# Altium schematic sheet controleSTM.SchDoc
size A2; SheetNumber: 1; SheetTotal: 2
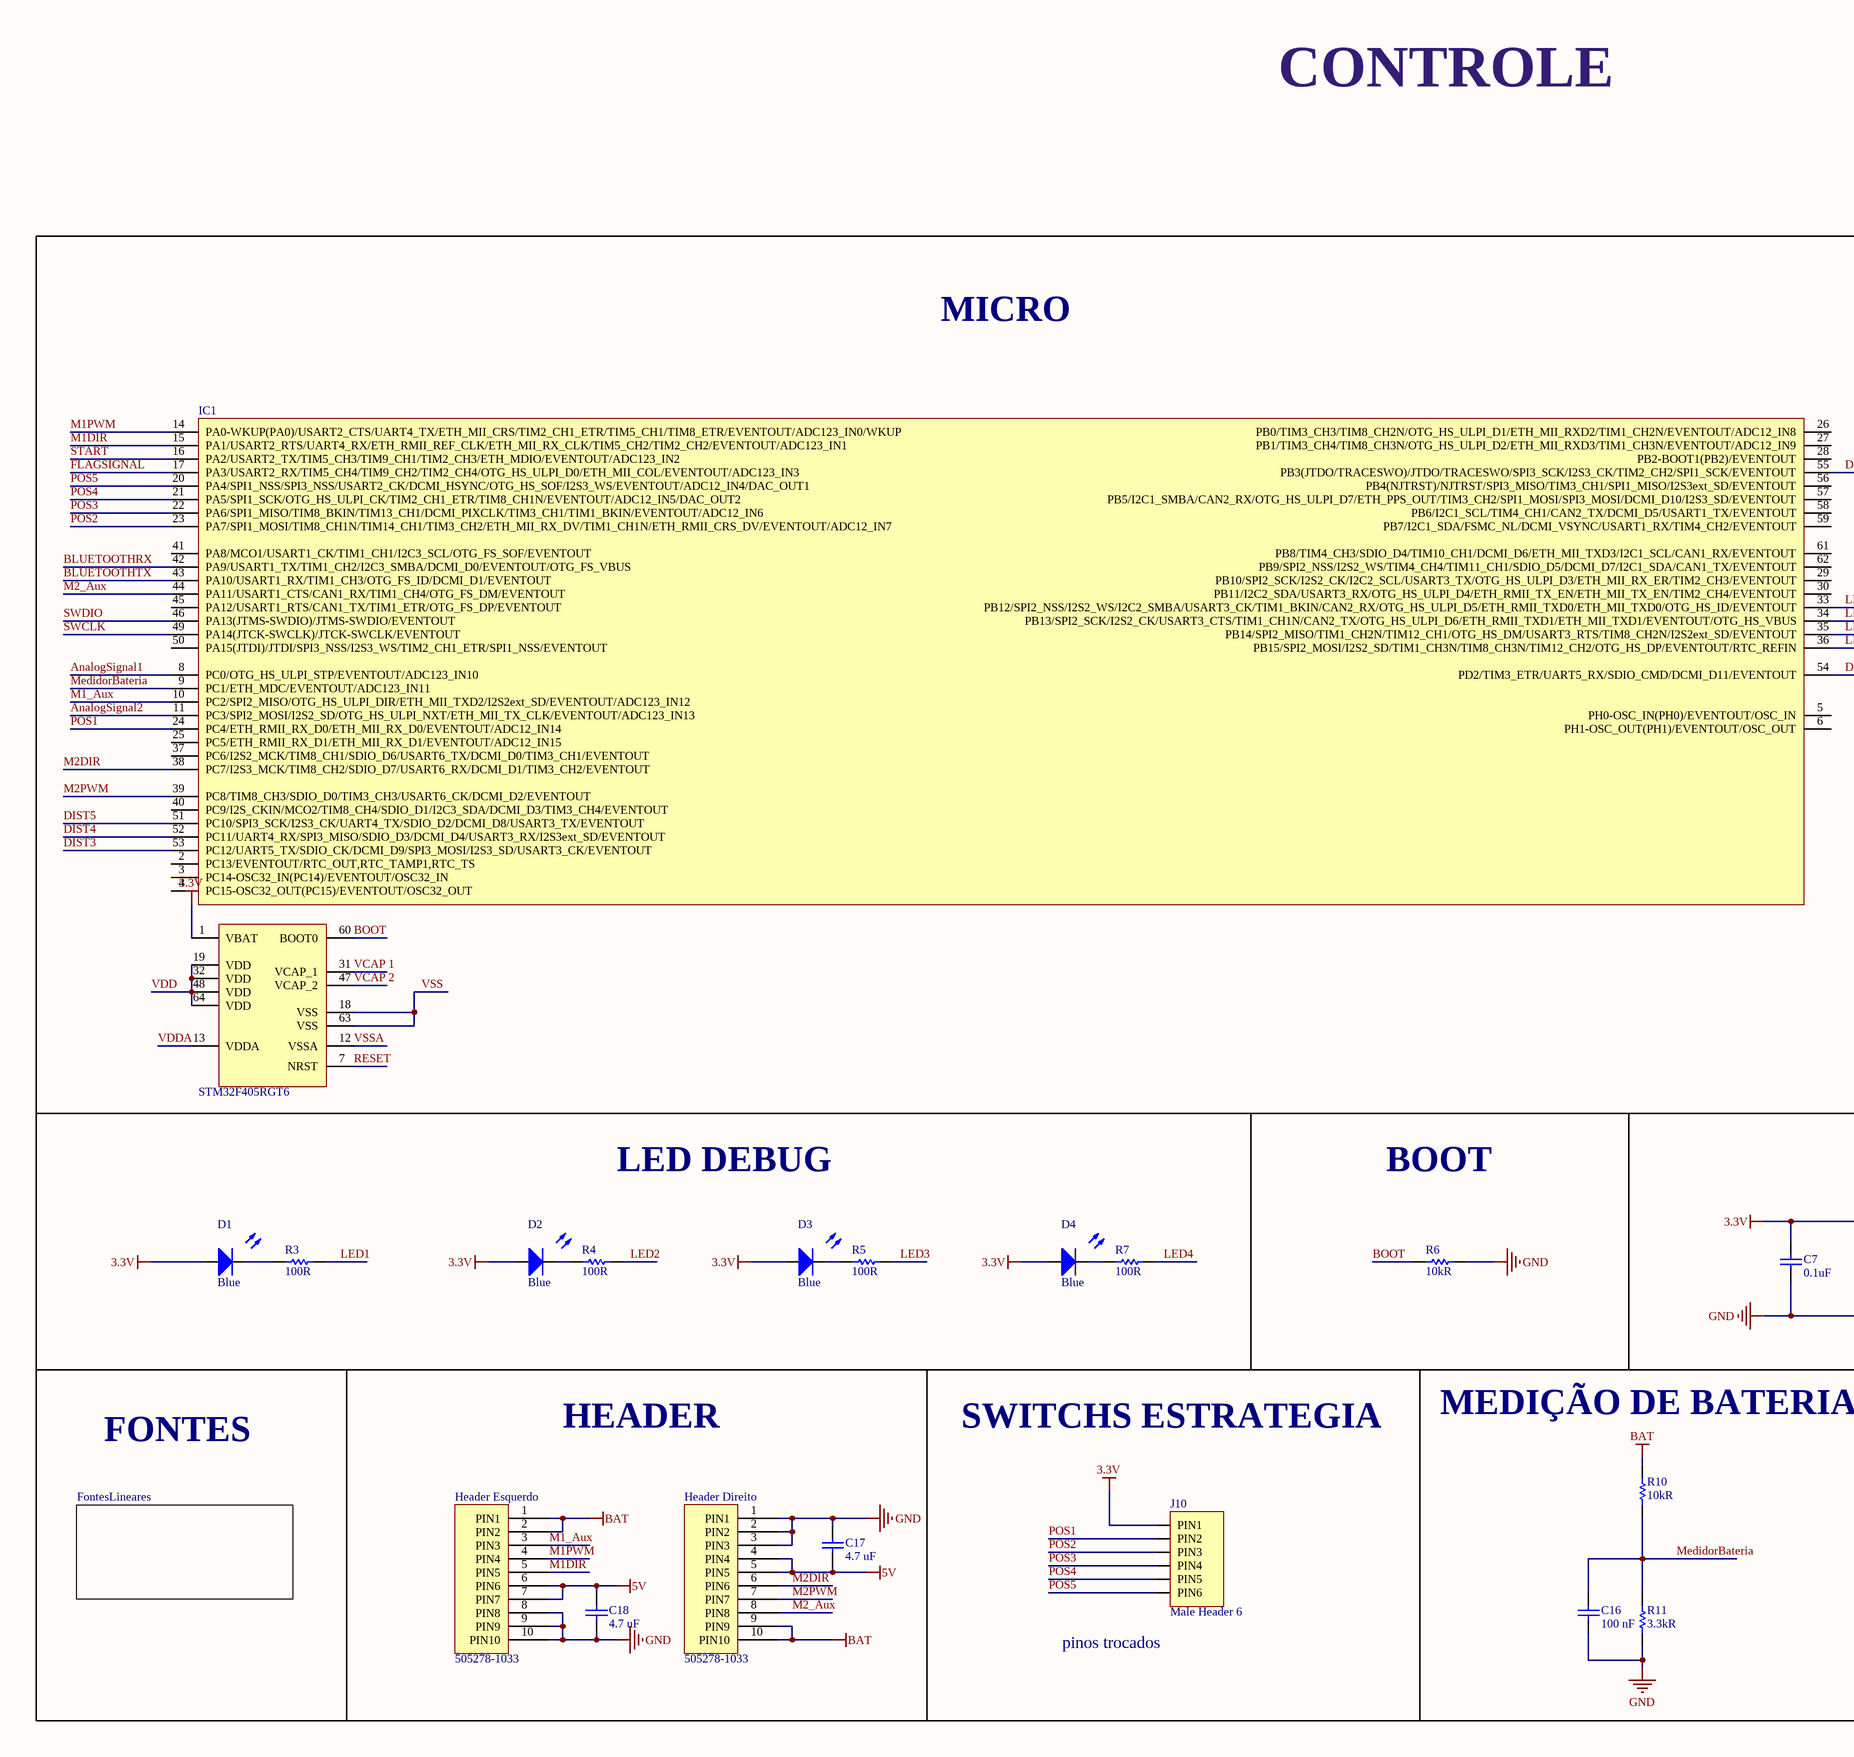
[diagram p0: controleSTM.SchDoc, left]
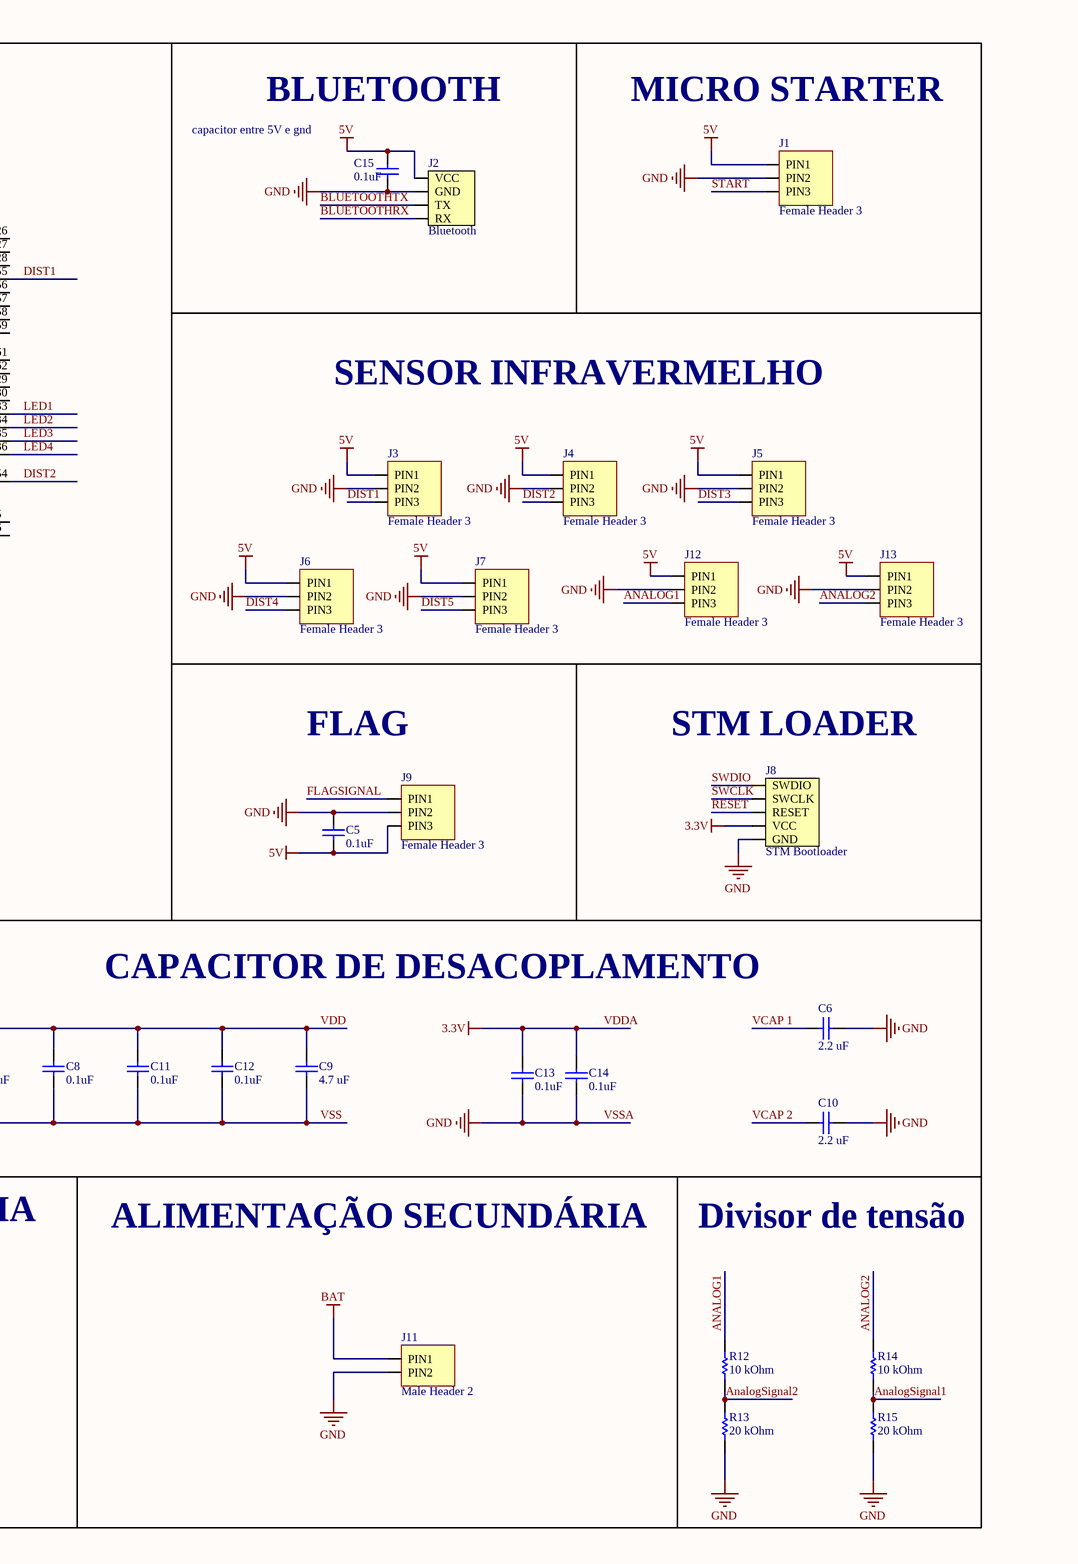
[diagram p1: controleSTM.SchDoc, right]

## Parts
C5  0.1uF  [C0805]
C6  2.2 uF  [C0805]
C7  0.1uF  [C0805]
C8  0.1uF  [C0805]
C9  4.7 uF  [C0805]
C10  2.2 uF  [C0805]
C11  0.1uF  [C0805]
C12  0.1uF  [C0805]
C13  0.1uF  [C0805]
C14  0.1uF  [C0805]
C15  0.1uF  [C0805]
C16  100 nF  [C0805]
C17  4.7 uF  [C0805]
C18  4.7 uF  [C0805]
D1  Blue  [DIODO_2-SMD-3215]
D2  Blue  [DIODO_2-SMD-3215]
D3  Blue  [DIODO_2-SMD-3215]
D4  Blue  [DIODO_2-SMD-3215]
Header_Direito  505278-1033  [FPC_CON]
Header_Esquerdo  505278-1033  [FPC_CON]
IC1  STM32F405RGT6  [LQFP-64]
J1  Female Header 3  [FEMALE HEADER 3]
J2  Bluetooth  [BLUETOOTH]
J3  Female Header 3  [FEMALE HEADER 3]
J4  Female Header 3  [FEMALE HEADER 3]
J5  Female Header 3  [FEMALE HEADER 3]
J6  Female Header 3  [FEMALE HEADER 3]
J7  Female Header 3  [FEMALE HEADER 3]
J8  STM Bootloader  [STM BOOTLOADER]
J9  Female Header 3  [FEMALE HEADER 3]
J10  Male Header 6  [MALE HEADER 6]
J11  Male Header 2  [MALE HEADER 2]
J12  Female Header 3  [FEMALE HEADER 3]
J13  Female Header 3  [FEMALE HEADER 3]
R3  100R  [RESISTOR_0805]
R4  100R  [RESISTOR_0805]
R5  100R  [RESISTOR_0805]
R6  10kR  [RESISTOR_0603]
R7  100R  [RESISTOR_0805]
R10  10kR  [RESISTOR_0603]
R11  3.3kR  [RESISTOR_0603]
R12  10 kOhm  [RESISTOR_0603]
R13  20 kOhm  [RESISTOR_0603]
R14  10 kOhm  [RESISTOR_0603]
R15  20 kOhm  [RESISTOR_0603]

## Sub-sheets
FontesLineares = FontesLineares: no entries

## Nets
5V: C5.1 C15.2 C17.1 C18.2 Header_Direito.4(PIN4) Header_Direito.5(PIN5) Header_Esquerdo.6(PIN6) Header_Esquerdo.7(PIN7) J1.PIN1 J2.VCC J3.PIN1 J4.PIN1 J5.PIN1 J6.PIN1 J7.PIN1 J9.PIN3 J12.PIN1 J13.PIN1
BAT: Header_Direito.9(PIN9) Header_Direito.10(PIN10) Header_Esquerdo.1(PIN1) Header_Esquerdo.2(PIN2) J11.PIN1 R10.2
VDD: C7.2 C8.2 C9.2 C11.2 C12.2 C13.2 C14.2 D1.A D2.A D3.A D4.A IC1.1(VBAT) IC1.13(VDDA) IC1.19(VDD) IC1.32(VDD) IC1.48(VDD) IC1.64(VDD) J8.VCC J10.PIN1  [also labelled 3.3V, VDDA]
VSS: C5.2 C6.2 C7.1 C8.1 C9.1 C10.2 C11.1 C12.1 C13.1 C14.1 C15.1 C16.1 C17.2 C18.1 Header_Direito.1(PIN1) Header_Direito.2(PIN2) Header_Direito.3(PIN3) Header_Esquerdo.8(PIN8) Header_Esquerdo.9(PIN9) Header_Esquerdo.10(PIN10) IC1.12(VSSA) IC1.18(VSS) IC1.63(VSS) J1.PIN2 J2.GND J3.PIN2 J4.PIN2 J5.PIN2 J6.PIN2 J7.PIN2 J8.GND J9.PIN2 J11.PIN2 J12.PIN2 J13.PIN2 R6.2 R11.1 R13.1 R15.1  [also labelled GND, VSSA]
ANALOG1: J12.PIN3 R12.2
ANALOG2: J13.PIN3 R14.2
AnalogSignal1: IC1.8(PC0/OTG_HS_ULPI_STP/EVENTOUT/ADC123_IN10) R14.1 R15.2
AnalogSignal2: IC1.11(PC3/SPI2_MOSI/I2S2_SD/OTG_HS_ULPI_NXT/ETH_MII_TX_CLK/EVENTOUT/ADC123_IN13) R12.1 R13.2
BLUETOOTHRX: IC1.42(PA9/USART1_TX/TIM1_CH2/I2C3_SMBA/DCMI_D0/EVENTOUT/OTG_FS_VBUS) J2.RX
BLUETOOTHTX: IC1.43(PA10/USART1_RX/TIM1_CH3/OTG_FS_ID/DCMI_D1/EVENTOUT) J2.TX
BOOT: IC1.60(BOOT0) R6.1
DIST1: IC1.55(PB3(JTDO/TRACESWO)/JTDO/TRACESWO/SPI3_SCK/I2S3_CK/TIM2_CH2/SPI1_SCK/EVENTOUT) J3.PIN3
DIST2: IC1.54(PD2/TIM3_ETR/UART5_RX/SDIO_CMD/DCMI_D11/EVENTOUT) J4.PIN3
DIST3: IC1.53(PC12/UART5_TX/SDIO_CK/DCMI_D9/SPI3_MOSI/I2S3_SD/USART3_CK/EVENTOUT) J5.PIN3
DIST4: IC1.52(PC11/UART4_RX/SPI3_MISO/SDIO_D3/DCMI_D4/USART3_RX/I2S3ext_SD/EVENTOUT) J6.PIN3
DIST5: IC1.51(PC10/SPI3_SCK/I2S3_CK/UART4_TX/SDIO_D2/DCMI_D8/USART3_TX/EVENTOUT) J7.PIN3
FLAGSIGNAL: IC1.17(PA3/USART2_RX/TIM5_CH4/TIM9_CH2/TIM2_CH4/OTG_HS_ULPI_D0/ETH_MII_COL/EVENTOUT/ADC123_IN3) J9.PIN1
LED1: IC1.33(PB12/SPI2_NSS/I2S2_WS/I2C2_SMBA/USART3_CK/TIM1_BKIN/CAN2_RX/OTG_HS_ULPI_D5/ETH_RMII_TXD0/ETH_MII_TXD0/OTG_HS_ID/EVENTOUT) R3.2
LED2: IC1.34(PB13/SPI2_SCK/I2S2_CK/USART3_CTS/TIM1_CH1N/CAN2_TX/OTG_HS_ULPI_D6/ETH_RMII_TXD1/ETH_MII_TXD1/EVENTOUT/OTG_HS_VBUS) R4.2
LED3: IC1.35(PB14/SPI2_MISO/TIM1_CH2N/TIM12_CH1/OTG_HS_DM/USART3_RTS/TIM8_CH2N/I2S2ext_SD/EVENTOUT) R5.2
LED4: IC1.36(PB15/SPI2_MOSI/I2S2_SD/TIM1_CH3N/TIM8_CH3N/TIM12_CH2/OTG_HS_DP/EVENTOUT/RTC_REFIN) R7.2
M1_Aux: Header_Esquerdo.3(PIN3) IC1.10(PC2/SPI2_MISO/OTG_HS_ULPI_DIR/ETH_MII_TXD2/I2S2ext_SD/EVENTOUT/ADC123_IN12)
M1DIR: Header_Esquerdo.5(PIN5) IC1.15(PA1/USART2_RTS/UART4_RX/ETH_RMII_REF_CLK/ETH_MII_RX_CLK/TIM5_CH2/TIM2_CH2/EVENTOUT/ADC123_IN1)
M1PWM: Header_Esquerdo.4(PIN4) IC1.14(PA0-WKUP(PA0)/USART2_CTS/UART4_TX/ETH_MII_CRS/TIM2_CH1_ETR/TIM5_CH1/TIM8_ETR/EVENTOUT/ADC123_IN0/WKUP)
M2_Aux: Header_Direito.8(PIN8) IC1.44(PA11/USART1_CTS/CAN1_RX/TIM1_CH4/OTG_FS_DM/EVENTOUT)
M2DIR: Header_Direito.6(PIN6) IC1.38(PC7/I2S3_MCK/TIM8_CH2/SDIO_D7/USART6_RX/DCMI_D1/TIM3_CH2/EVENTOUT)
M2PWM: Header_Direito.7(PIN7) IC1.39(PC8/TIM8_CH3/SDIO_D0/TIM3_CH3/USART6_CK/DCMI_D2/EVENTOUT)
MedidorBateria: C16.2 IC1.9(PC1/ETH_MDC/EVENTOUT/ADC123_IN11) R10.1 R11.2
POS1: IC1.24(PC4/ETH_RMII_RX_D0/ETH_MII_RX_D0/EVENTOUT/ADC12_IN14) J10.PIN2
POS2: IC1.23(PA7/SPI1_MOSI/TIM8_CH1N/TIM14_CH1/TIM3_CH2/ETH_MII_RX_DV/TIM1_CH1N/ETH_RMII_CRS_DV/EVENTOUT/ADC12_IN7) J10.PIN3
POS3: IC1.22(PA6/SPI1_MISO/TIM8_BKIN/TIM13_CH1/DCMI_PIXCLK/TIM3_CH1/TIM1_BKIN/EVENTOUT/ADC12_IN6) J10.PIN4
POS4: IC1.21(PA5/SPI1_SCK/OTG_HS_ULPI_CK/TIM2_CH1_ETR/TIM8_CH1N/EVENTOUT/ADC12_IN5/DAC_OUT2) J10.PIN5
POS5: IC1.20(PA4/SPI1_NSS/SPI3_NSS/USART2_CK/DCMI_HSYNC/OTG_HS_SOF/I2S3_WS/EVENTOUT/ADC12_IN4/DAC_OUT1) J10.PIN6
RESET: IC1.7(NRST) J8.RESET
START: IC1.16(PA2/USART2_TX/TIM5_CH3/TIM9_CH1/TIM2_CH3/ETH_MDIO/EVENTOUT/ADC123_IN2) J1.PIN3
SWCLK: IC1.49(PA14(JTCK-SWCLK)/JTCK-SWCLK/EVENTOUT) J8.CLK(SWCLK)
SWDIO: IC1.46(PA13(JTMS-SWDIO)/JTMS-SWDIO/EVENTOUT) J8.DIO(SWDIO)
VCAP 1: C6.1 IC1.31(VCAP_1)
VCAP 2: C10.1 IC1.47(VCAP_2)
NetD1_C: D1.C R3.1
NetD2_C: D2.C R4.1
NetD3_C: D3.C R5.1
NetD4_C: D4.C R7.1

Not connected (* = marked no-connect by the designer): IC1 2(PC13/EVENTOUT/RTC_OUT,RTC_TAMP1,RTC_TS) 3(PC14-OSC32_IN(PC14)/EVENTOUT/OSC32_IN) 4(PC15-OSC32_OUT(PC15)/EVENTOUT/OSC32_OUT) 5(PH0-OSC_IN(PH0)/EVENTOUT/OSC_IN) 6(PH1-OSC_OUT(PH1)/EVENTOUT/OSC_OUT) 25(PC5/ETH_RMII_RX_D1/ETH_MII_RX_D1/EVENTOUT/ADC12_IN15) 26(PB0/TIM3_CH3/TIM8_CH2N/OTG_HS_ULPI_D1/ETH_MII_RXD2/TIM1_CH2N/EVENTOUT/ADC12_IN8) 27(PB1/TIM3_CH4/TIM8_CH3N/OTG_HS_ULPI_D2/ETH_MII_RXD3/TIM1_CH3N/EVENTOUT/ADC12_IN9) 28(PB2-BOOT1(PB2)/EVENTOUT) 29(PB10/SPI2_SCK/I2S2_CK/I2C2_SCL/USART3_TX/OTG_HS_ULPI_D3/ETH_MII_RX_ER/TIM2_CH3/EVENTOUT) 30(PB11/I2C2_SDA/USART3_RX/OTG_HS_ULPI_D4/ETH_RMII_TX_EN/ETH_MII_TX_EN/TIM2_CH4/EVENTOUT) 37(PC6/I2S2_MCK/TIM8_CH1/SDIO_D6/USART6_TX/DCMI_D0/TIM3_CH1/EVENTOUT) 40(PC9/I2S_CKIN/MCO2/TIM8_CH4/SDIO_D1/I2C3_SDA/DCMI_D3/TIM3_CH4/EVENTOUT) 41(PA8/MCO1/USART1_CK/TIM1_CH1/I2C3_SCL/OTG_FS_SOF/EVENTOUT) 45(PA12/USART1_RTS/CAN1_TX/TIM1_ETR/OTG_FS_DP/EVENTOUT) 50(PA15(JTDI)/JTDI/SPI3_NSS/I2S3_WS/TIM2_CH1_ETR/SPI1_NSS/EVENTOUT) 56(PB4(NJTRST)/NJTRST/SPI3_MISO/TIM3_CH1/SPI1_MISO/I2S3ext_SD/EVENTOUT) 57(PB5/I2C1_SMBA/CAN2_RX/OTG_HS_ULPI_D7/ETH_PPS_OUT/TIM3_CH2/SPI1_MOSI/SPI3_MOSI/DCMI_D10/I2S3_SD/EVENTOUT) 58(PB6/I2C1_SCL/TIM4_CH1/CAN2_TX/DCMI_D5/USART1_TX/EVENTOUT) 59(PB7/I2C1_SDA/FSMC_NL/DCMI_VSYNC/USART1_RX/TIM4_CH2/EVENTOUT) 61(PB8/TIM4_CH3/SDIO_D4/TIM10_CH1/DCMI_D6/ETH_MII_TXD3/I2C1_SCL/CAN1_RX/EVENTOUT) 62(PB9/SPI2_NSS/I2S2_WS/TIM4_CH4/TIM11_CH1/SDIO_D5/DCMI_D7/I2C1_SDA/CAN1_TX/EVENTOUT)

## Notes on the sheet
- CONTROLE
- MICRO
- capacitor entre 5V e gnd
- BLUETOOTH
- MICRO STARTER
- SENSOR INFRAVERMELHO
- FLAG
- (near J8) STM LOADER
- LED DEBUG
- BOOT
- CAPACITOR DE DESACOPLAMENTO
- FONTES
- HEADER
- SWITCHS ESTRATEGIA
- MEDIÇÃO DE BATERIA
- ALIMENTAÇÃO SECUNDÁRIA
- Divisor de tensão
- (near J10) pinos trocados

## Library data of the parts
C5 C7 C8 C11-C15 = C0805C104M3RACTU: CAP CER 0.1uF 25V X7R 0805; Manufacturer: Kemet; Tolerance: 20%; Voltage - Rated: 25 VDC; Library Control - Checked Footprint: No; Library Control - Checked Schematic: Yes; Library Control - Person that Checked Schematic: Guilherme; Library Control - Person that did the Last Update Schematic: Marcos; Supplier 1: Mouser; Part Number: C0805C104M3RACTU; Category: Ceramic Capacitor; Price: 1=0,13 10=0,064 100=0,037 1000=0,025 (USD); Supplier Part Number 1: 80-C0805C104M3R; Library Ref: Capacitor; Operating Temperature: -55 C ~ 125 C; Package / Case: 0805(2012 mestric); Size / Dimension: 1.25 mm W x 2 mm L x 0.78 mm H; Value: 0.1uF; ESR: -; Dieletric: X7R; Library Control - Last Update: 26/06/2021 20:52; ComponentLink1Description: Datasheet; ComponentLink1URL: https://br.mouser.com/datasheet/2/212/KEM_C1002_X7R_SMD-1102033.pdf; ComponentLink2Description: Mouser Link; ComponentLink2URL: https://br.mouser.com/ProductDetail/KEMET/C0805C104M3RACTU?qs=jbCUrP3sAgSIdMuvv9W4Pg%3D%3D
C6 C10 = GCM21BR71C225KA64L: CAP CER 2.2uF 16V X7R 0805; Manufacturer: MURATA ELECTRONICS; Tolerance: 10%; Voltage - Rated: 16 VDC; Library Control - Checked Footprint: Yes; Library Control - Person that Checked Footprint: Cage; Supplier 1: Mouser; Part Number: GCM21BR71C225KA64L; Category: Ceramic capacitor; Price: 1=0,41 10=0,283 100=0,169 1000=0,107 (USD); Supplier Part Number 1: 81-GCM21BR71C225KA4L; Library Ref: Capacitor; Operating Temperature: -55°C ~125ºC; Package / Case: 0805(2012 Metric); Size / Dimension: 2 mm L  x 1.25 mm W x 1.25 mm H; Value: 2.2 uF; ESR: -; Dieletric: X7R; Library Control - Checked Schematic: Yes; Library Control - Last Update: 25/08/22; Library Control - Person that Checked Schematic: Cage; Library Control - Person that did the Last Update Footprint: Cage; Library Control - Person that did the Last Update Schematic: Cage; ComponentLink1Description: Datasheet; ComponentLink1URL: https://br.mouser.com/ProductDetail/Murata-Electronics/GCM21BR71C225KA64L?qs=aEuGZpxfbxV0E5XH%252BwYupA%3D%3D; ComponentLink2Description: Mouser Link; ComponentLink2URL: https://br.mouser.com/ProductDetail/Murata-Electronics/GCM21BR71C225KA64L?qs=aEuGZpxfbxV0E5XH%252BwYupA%3D%3D
C9 C17 C18 = GRM219R61E475KA73D: CAP CER 4.7uF 25V X5R 0805; Manufacturer: MURATA ELECTRONICS; Tolerance: 10%; Voltage - Rated: 25 VDC; Library Control - Checked Footprint: Yes; Library Control - Person that Checked Footprint: Cage; Supplier 1: Mouser; Part Number: GRM219R61E475KA73D; Category: Ceramic Capacitors; Price: 1=0,28 10=0,193 100=0,098 1000=0,059 (USD); Supplier Part Number 1: 81-GRM219R61E475KA73D; Library Ref: Capacitor; Operating Temperature: -55°C ~ 85°C; Package / Case: 0805(2012 metric); Size / Dimension: 2 mm L x 1.25 mm W x 0.85 mm H; ESR: -; Dieletric: X5R; Library Control - Checked Schematic: Yes; Library Control - Last Update: 25/08/22; Library Control - Person that Checked Schematic: Cage; Library Control - Person that did the Last Update Footprint: Cage; Library Control - Person that did the Last Update Schematic: Cage; ComponentLink1Description: Datasheet; ComponentLink1URL: https://br.mouser.com/datasheet/2/281/1/GRM219R61E475KA73_01A-1986363.pdf; ComponentLink2Description: Mouser Link; ComponentLink2URL: https://br.mouser.com/ProductDetail/Murata-Electronics/GRM219R61E475KA73D?qs=%2Fha2pyFadui1540apPxqrcvNL2Od6%2FE9q78FE8iyERiL9ZO4NhnlONCgyc%2FC2rEQ; Value: 4.7 uF
C16 = 885012207128: CAP CER 100 nF 100V X7R 0805; Manufacturer: Wurth Elektronik; Tolerance: 10%; Voltage - Rated: 100 VDC; Library Control - Checked Footprint: Yes; Supplier 1: Mouser; Part Number: 885012207128; Category: Ceramic capacitor; Price: 1=0,41 10=0,283 100=0,169 1000=0,107 (USD); Supplier Part Number 1: 710-885012207128; Library Ref: Capacitor; Operating Temperature: -55°C ~125ºC; Package / Case: 0805(2012 Metric); Size / Dimension: 2 mm L  x 1.25 mm W x 1.25 mm H; Value: 100 nF; ESR: -; Dieletric: X7R; Library Control - Checked Schematic: Yes; ComponentLink1Description: Datasheet; ComponentLink1URL: https://br.mouser.com/datasheet/2/445/885012207128-1727772.pdf; ComponentLink2Description: Mouser Link; ComponentLink2URL: https://br.mouser.com/ProductDetail/Wurth-Elektronik/885012207128?qs=MLItCLRbWsys1TnbPEYt%252BQ%3D%3D
D1-D4 = EAST3215BA5: LED 75mW BLUE 45MCD 3215; Manufacturer: Everlight Electronics; Current - Forward (If): 20 mA; Voltage - Forward (Vf): 3,30 V; Viewing Angle: 130°; Wavelength: 468 nm; Reverse Voltage: 5 V; Library Control - Checked Footprint: yes; Library Control - Person that Checked Footprint: Lucas; Library Control - Person that did the Last Update Footprint: Stéfany (Ster); Supplier 1: Mouser; Part Number: EAST3215BA5; Category: Standard LEDs - SMD; Price: 1 = 0,3800, 10 = 0,2050, 100 = 0.1080 (USD); Package / Case: 3215; Color: Blue; Operating Temperature: - 40 °C ~ 85 °C; Luminous Intensity: 45 mcd; Library Ref: Diodo/Led; Supplier Part Number 1: 638-EAST3215BA5; Max Power Dissipation: 75 mW; Max Current Rating: 20 mA; Library Control - Checked Schematic: yes; Library Control - Last Update: 13/06/2021 12:45; Library Control - Person that Checked Schematic: Lucas; Library Control - Person that did the Last Update Schematic: Stéfany (Ster); ComponentLink1Description: Mouser Link; ComponentLink1URL: https://www.mouser.com/ProductDetail/Everlight/EAST3215BA5?qs=Cqqh%252BS766wnzp9nQVj5A4g==; ComponentLink2Description: Datasheet; ComponentLink2URL: https://www.mouser.com/datasheet/2/143/EAST3215BA5-1154292.pdf
Header_Direito Header_Esquerdo = 505278-1033_BODY: CONN FFC/FPC HORZ 10POS 0.50MM; Manufacturer: Molex; Current Rating (Amps): 500mA; Number of Positions: 10; Library Control - Checked Footprint: Yes; Library Control - Last Project that Used: Follow-Final; Library Control - Person that Checked Footprint: Lucas; Library Control - Person that did the Last Update Footprint: Mateus(Dimas); Supplier 1: Mouser; Part Number: 505278-1033; Category: Connectors; Price: 1=0,51000, 10=0,42900, 100=0,33400 (USD); Mounting Type: Right Angle; Contact Material: Tin; Operating Temperature: -40°C ~ 85°C; Library Ref: Connectors; Number of Rows: 1; Termination: SMD; Insulation Material: Liquid Crystal Polymer; Contact Type: FFC/FPC; Pitch: 0.50mm; Contact Length - Mating: 0.50mm; Supplier Part Number 1: 538-505278-1033; Library Control - Checked Schematic: Yes; Library Control - Last Update: 24/04/2021 00:25; Library Control - Person that Checked Schematic: Lucas; Library Control - Person that did the Last Update Schematic: Mateus(Dimas); ComponentLink1Description: Datasheet; ComponentLink1URL: https://br.mouser.com/datasheet/2/276/2/5052781033_FFC_FPC_CONNECTORS-772019.pdf; ComponentLink2Description: Mouser Link; ComponentLink2URL: https://br.mouser.com/ProductDetail/Molex/505278-1033?qs=c8NFF48pVsDStgrQCBOSTg%3D%3D
IC1 = STM32F405RGT6: IC MCU 32-BIT 192kB FLASH ARM Cortex-M4 168MHz  LQFP-64; Manufacturer: STM; Number of I/Os: 51; Oscillator Type: Internal; Program Memory Size: 1024kB; Peripherals: CAN, I2C, SDIO, I2S / SPI, UART / USART, USB; Core Processor: ARM Cortex M0+; Voltage - Supply (Vcc/Vdd): 1.8 V to 3.6 V; Number of Timers/Counters: 17; Number of ADC Channels: 16; Number of SPI Channels: 3; Number of UART/USART Channels: 4; Library Control - Person that did the Last Update Footprint: Marcos; Supplier 1: Mouser; Part Number: STM32F405RGT6; Category: ARM Microcontrollers - MCU; Price: 1 = 12,95, 10 = 11,91,  100 = 11,42, 500 = 8,95 (USD); Package/Case: LQFP-64; Operating Temperature: -40°C to 85°C; Connectivity: -; Speed: 168MHz; Program Memory Type: Flash; RAM Size: 192k B; Core Size: *; Number of I2C Channels: 3; Number of Ethernet Channels: -; Series: STM32F405RG; Library Ref: Microcrontrollers; Supplier Part Number 1: 511-STM32F405RGT6; Library Control - Checked Footprint: *; Library Control - Checked Schematic: *; Library Control - Last Project that Used: *; Library Control - Last Update: 22/08/21 15:09; Library Control - Person that Checked Footprint: *; Library Control - Person that Checked Schematic: *; Library Control - Person that did the Last Update Schematic: Marcos; ComponentLink1Description: Mouser Link; ComponentLink1URL: https://www.mouser.com/ProductDetail/STMicroelectronics/STM32F405RGT6?qs=Z8%252BeY1k3TIKgj7QWsYGpQw%3D%3D; ComponentLink2Description: Datasheet Link; ComponentLink2URL: https://www.mouser.com/datasheet/2/389/dm00037051-1797298.pdf
J1 J3-J7 J9 J12 J13 = Female Header 3: Number of Contacts: 3; System: Connector; Library Ref: Header
J2 = Barramento Bluetooth: BARRAMENTO BLUETOOTH HC-06; Number of Contacts: 4; Bluetooth Mode: Slave Only; Operating Voltage: 3,6 / 6 (V); Max Range: 10m; Frequency: 2,4 GHz; Modulation: GFSK (Gaussian Frequency Shift Keying); Recomended Operating Configuration: 5V @ 50mA; Maximum Serial Transmission Rate: 9600 bps; Library Ref: Header
J8 = Barramento de Gravação STM: BARRAMENTO DE GRAVAÇÃO; Number of Contacts: 5; Library Ref: Header
J10 = Male Header 6: Number of Contacts: 6; Library Control - Checked Footprint: Yes; Library Control - Person that Checked Footprint: Cage; System: Connector; Library Ref: Header; Library Control - Checked Schematic: Yes; Library Control - Last Project that Used: *; Library Control - Last Update: 02/10/2022; Library Control - Person that Checked Schematic: Cage; Library Control - Person that did the Last Update Schematic: Cage; Library Control - Persont that did the Last Update Footprint: Cage
J11 = Male Header 2: Number of Contacts: 2; Library Control - Person that did the Last Update Schematic: Marcos; System: Connector; Library Ref: Header; Library Control - Checked Footprint: *; Library Control - Checked Schematic: *; Library Control - Last Project that Used: *; Library Control - Last Update: *; Library Control - Person that Checked Footprint: *; Library Control - Person that Checked Schematic: *; Library Control - Persont that did the Last Update Footprint: Marcos
R3-R5 R7 = CRCW0805100RFKEA: RES SMD 100 OHM 1% 1/8W 0805; Manufacturer: Vishay / Dale; Temperature Coefficient: 100 PPM / C; Power Rating: 125 mW (1/8 W); Voltage Rating: 150 V; Library Control - Checked Footprint: No; Library Control - Checked Schematic: Yes; Library Control - Person that Checked Schematic: Marcos; Library Control - Person that did the Last Update Footprint: Dalarme; Supplier 1: Mouser; Part Number: CRCW0805100RFKEA; Category: Thick Film Resistors - SMD; Price: 1=0,18, 10=0,065, 100=0,027, 1000=0,012 (USD); Package / Case: 0805 (2012 Metric); Operating Temperature: - 55ºC ~ 155ºC; Value: 100R; Tolerance: 1 %; Library Ref: Resistor; Resistor Type: Fixo; Size / Dimension: 2 mm L x  1.25 mm W x  0.45 mm H; Supplier Part Number 1: 71-CRCW0805-100-E3; Library Control - Last Update: 20/06/21 16:56; Library Control - Person that did the Last Update Schematic: Marcos; ComponentLink1Description: Mouser Link; ComponentLink1URL: https://www.mouser.com/ProductDetail/Vishay-Dale/CRCW0805100RFKEA?qs=sGAEpiMZZMu61qfTUdNhG2DpbjADlD3GxPcNG3UnvYk%3D; ComponentLink2Description: Datasheet Link; ComponentLink2URL: https://www.mouser.com/datasheet/2/427/dcrcwe3-1762152.pdf
R6 R10 = RC0603JR-0710KL: RES SMD 10K OHM 5% 1/10W 0603; Manufacturer: Yageo; Temperature Coefficient: 100 PPM / C; Power Rating: 100 mW (1/10 W); Voltage Rating: 75 V; Library Control - Checked Footprint: No; Library Control - Checked Schematic: Yes; Library Control - Person that Checked Schematic: Marcos; Library Control - Person that did the Last Update Footprint: Dalarme; Supplier 1: Mouser; Part Number: RC0603JR-0710KL; Category: Thick Film Resistors - SMD; Price: 1=0,10, 10=0,015, 100=0,005 1000=0,0040 (USD); Package / Case: 0603 (1608 Metric); Operating Temperature: - 55ºC ~ 155ºC; Value: 10kR; Tolerance: 5 %; Library Ref: Resistor; Resistor Type: Fixo; Size / Dimension: 1.6 mm L x  0.8 mm W x  0.45 mm H; Supplier Part Number 1: 603-RC0603JR-0710KL; Library Control - Last Update: 21/06/21 14:15; Library Control - Person that did the Last Update Schematic: Marcos; ComponentLink1Description: Mouser Link; ComponentLink1URL: https://br.mouser.com/ProductDetail/Yageo/RC0603JR-0710KL?qs=ksOUTF%2FWcd8D6T22BJkQ7g%3D%3D; ComponentLink2Description: Datsheet Link; ComponentLink2URL: https://br.mouser.com/datasheet/2/447/Yageo_03_18_2021_PYu_RC_Group_51_RoHS_L_11-2199992.pdf
R11 = CRGCQ0603F3K3: RES SMD 3.3K OHM 1% 1/10W 0603; Manufacturer: TE Connectivity / Holsworthy; Temperature Coefficient: 100 PPM / C; Power Rating: 100 mW (1/10 W); Voltage Rating: 75 V; Library Control - Checked Footprint: Yes; Library Control - Person that Checked Footprint: Nikaum; Library Control - Person that Checked Schematic: Guilherme; Library Control - Person that did the Last Update Footprint: Dalarme; Supplier 1: Mouser; Part Number: CRGCQ0603F3K3; Category: Thick Film Resistors; Price: 1=0,10, 10=0,029, 100=0,011 (USD); Package / Case: 0603 (1608 Metric); Operating Temperature: - 55ºC ~ 125ºC; Value: 3.3kR; Tolerance: 1 %; Library Ref: Resistor; Resistor Type: Fixed; Size / Dimension: 1.6 mm L x  0.8 mm W x  0.45 mm H; Supplier Part Number 1: 279-CRGCQ0603F3K3; Library Control - Checked Schematic: Yes; Library Control - Last Update: 27/06/2021 20:27; Library Control - Person that did the Last Update Schematic: Dalarme; ComponentLink1Description: Mouser Link; ComponentLink1URL: https://br.mouser.com/ProductDetail/TE-Connectivity-Holsworthy/CRGCQ0603F3K3?qs=sGAEpiMZZMvdGkrng054t7z4BkURc4Lz7mzhBruKq8fwVJ16OlxZFQ%3D%3D; ComponentLink2Description: Datasheet; ComponentLink2URL: https://br.mouser.com/datasheet/2/418/4/NG_DS_1773204-3_1-1358553.pdf
R12 R14 = CRCW060310K0FKEBC: RES SMD 10 kOHM 1% 1/10W 0603; Manufacturer: Vishay; Temperature Coefficient: 100 PPM / C; Power Rating: 100mW (1/10 W); Voltage Rating: 75 V; Supplier 1: Mouser; Part Number: CRCW060310K0FKEBC; Category: Thick Film Resistors - SMD; Price: 1 = 0,10, 10 = 0,032, 100 = 0,013 (USD); Package / Case: 0603 (1608 metric); Operating Temperature: - 55 C~155 C; Value: 10 kOhm; Tolerance: 1 %; Library Ref: Resistor; Resistor Type: Fixo; Size / Dimension: 1,60 L x 0,80 W x 0,45 H; Supplier Part Number 1: 71-CRCW060310K0FKEBC; ComponentLink1Description: Mouser Link; ComponentLink1URL: https://br.mouser.com/ProductDetail/Vishay-Dale/CRCW060310K0FKEBC?qs=wd5RIQLrsJiqANp9xmDb7A%3D%3D; ComponentLink2Description: Datasheet Link; ComponentLink2URL: https://br.mouser.com/datasheet/2/427/crcwce3-1762584.pdf
R13 R15 = ERJ-3GEYJ203V: RES SMD 20 kOHM 1% 1/10W 0603; Manufacturer: Panasonic; Tolerance: 5 %; Temperature Coefficient: 100 PPM / C; Power Rating: 100mW (1/10 W); Voltage Rating: 75 V; Supplier 1: Mouser; Part Number: ERJ-3GEYJ203V; Category: Thick Film Resistors - SMD; Price: 1 = 0,10, 10 = 0,032, 100 = 0,013 (USD); Package / Case: 0603 (1608 metric); Operating Temperature: - 55 C~155 C; Value: 20 kOhm; Library Ref: Resistor; Resistor Type: Fixo; Size / Dimension: 1,60 L x 0,80 W x 0,45 H; Supplier Part Number 1: 667-ERJ-3GEYJ203V; ComponentLink1Description: Mouser Link; ComponentLink1URL: https://br.mouser.com/ProductDetail/Panasonic/ERJ-3GEYJ203V?qs=4WZYzuGhm5oR10lJ%252BqFZyQ%3D%3D; ComponentLink2Description: Datasheet Link; ComponentLink2URL: https://br.mouser.com/datasheet/2/315/AOA0000C301-1488782.pdf